# Altium schematic sheet ВХ Б (1-6).SchDoc
size A3; Organization: Altium Limited; Address1: L3, 12a Rodborough Rd; Address2: Frenchs Forest; Address3: NSW; Address4: Australia 2086; SheetNumber: 4; SheetTotal: 5
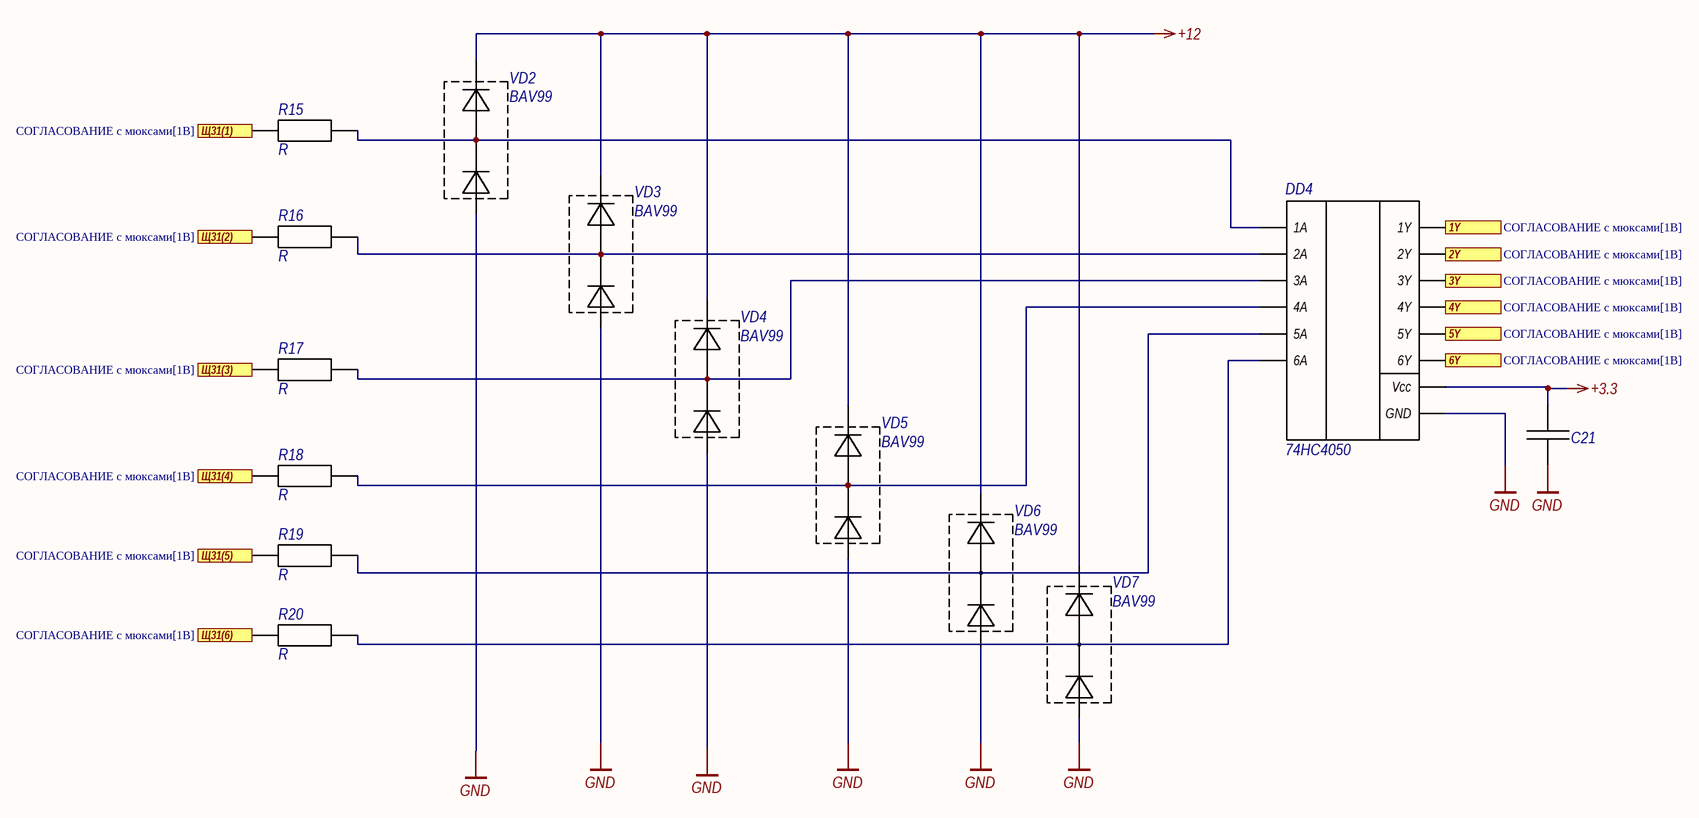
[diagram p0: ВХ Б (1-6).SchDoc]

## Parts
C21  C(ceramic)  [C(ceramic)]  (value not drawn)
DD4  74HC4050  [74HC4050(51)]
R15  R  [R]
R16  R  [R]
R17  R  [R]
R18  R  [R]
R19  R  [R]
R20  R  [R]
VD2  BAV99  [BAV99]
VD3  BAV99  [BAV99]
VD4  BAV99  [BAV99]
VD5  BAV99  [BAV99]
VD6  BAV99  [BAV99]
VD7  BAV99  [BAV99]

## Ports
1Y (see СОГЛАСОВАНИЕ с мюксами[1B]), 2Y (see СОГЛАСОВАНИЕ с мюксами[1B]), 3Y (see СОГЛАСОВАНИЕ с мюксами[1B]), 4Y (see СОГЛАСОВАНИЕ с мюксами[1B]), 5Y (see СОГЛАСОВАНИЕ с мюксами[1B]), 6Y (see СОГЛАСОВАНИЕ с мюксами[1B]), Щ31(1) (see СОГЛАСОВАНИЕ с мюксами[1B]), Щ31(2) (see СОГЛАСОВАНИЕ с мюксами[1B]), Щ31(3) (see СОГЛАСОВАНИЕ с мюксами[1B]), Щ31(4) (see СОГЛАСОВАНИЕ с мюксами[1B]), Щ31(5) (see СОГЛАСОВАНИЕ с мюксами[1B]), Щ31(6) (see СОГЛАСОВАНИЕ с мюксами[1B])

## Nets
+3.3: C21.1 DD4.1(Vcc)
+12: VD2.2 VD3.2 VD4.2 VD5.2 VD6.2 VD7.2
GND: C21.2 DD4.8(GND) VD2.1 VD3.1 VD4.1 VD5.1 VD6.1 VD7.1
1Y: DD4.2(1Y) ; port 1Y
2Y: DD4.4(2Y) ; port 2Y
3Y: DD4.6(3Y) ; port 3Y
4Y: DD4.10(4Y) ; port 4Y
5Y: DD4.12(5Y) ; port 5Y
6Y: DD4.15(6Y) ; port 6Y
Щ31(1): R15.1 ; port Щ31(1)
Щ31(2): R16.1 ; port Щ31(2)
Щ31(3): R17.1 ; port Щ31(3)
Щ31(4): R18.1 ; port Щ31(4)
Щ31(5): R19.1 ; port Щ31(5)
Щ31(6): R20.1 ; port Щ31(6)
NetDD4_3: DD4.3(1A) R15.2 VD2.3
NetDD4_5: DD4.5(2A) R16.2 VD3.3
NetDD4_7: DD4.7(3A) R17.2 VD4.3
NetDD4_9: DD4.9(4A) R18.2 VD5.3
NetDD4_11: DD4.11(5A) R19.2 VD6.3
NetDD4_14: DD4.14(6A) R20.2 VD7.3

## Notes on the sheet
- Title
- Size:
- Date:
- A3
- Number:
- Time:
- Revision:
- Sheet
- of
- File: